# Altium schematic sheet STM32G473RET6_PINOUT.SchDoc
size C; SheetNumber: 14; SheetTotal: 19
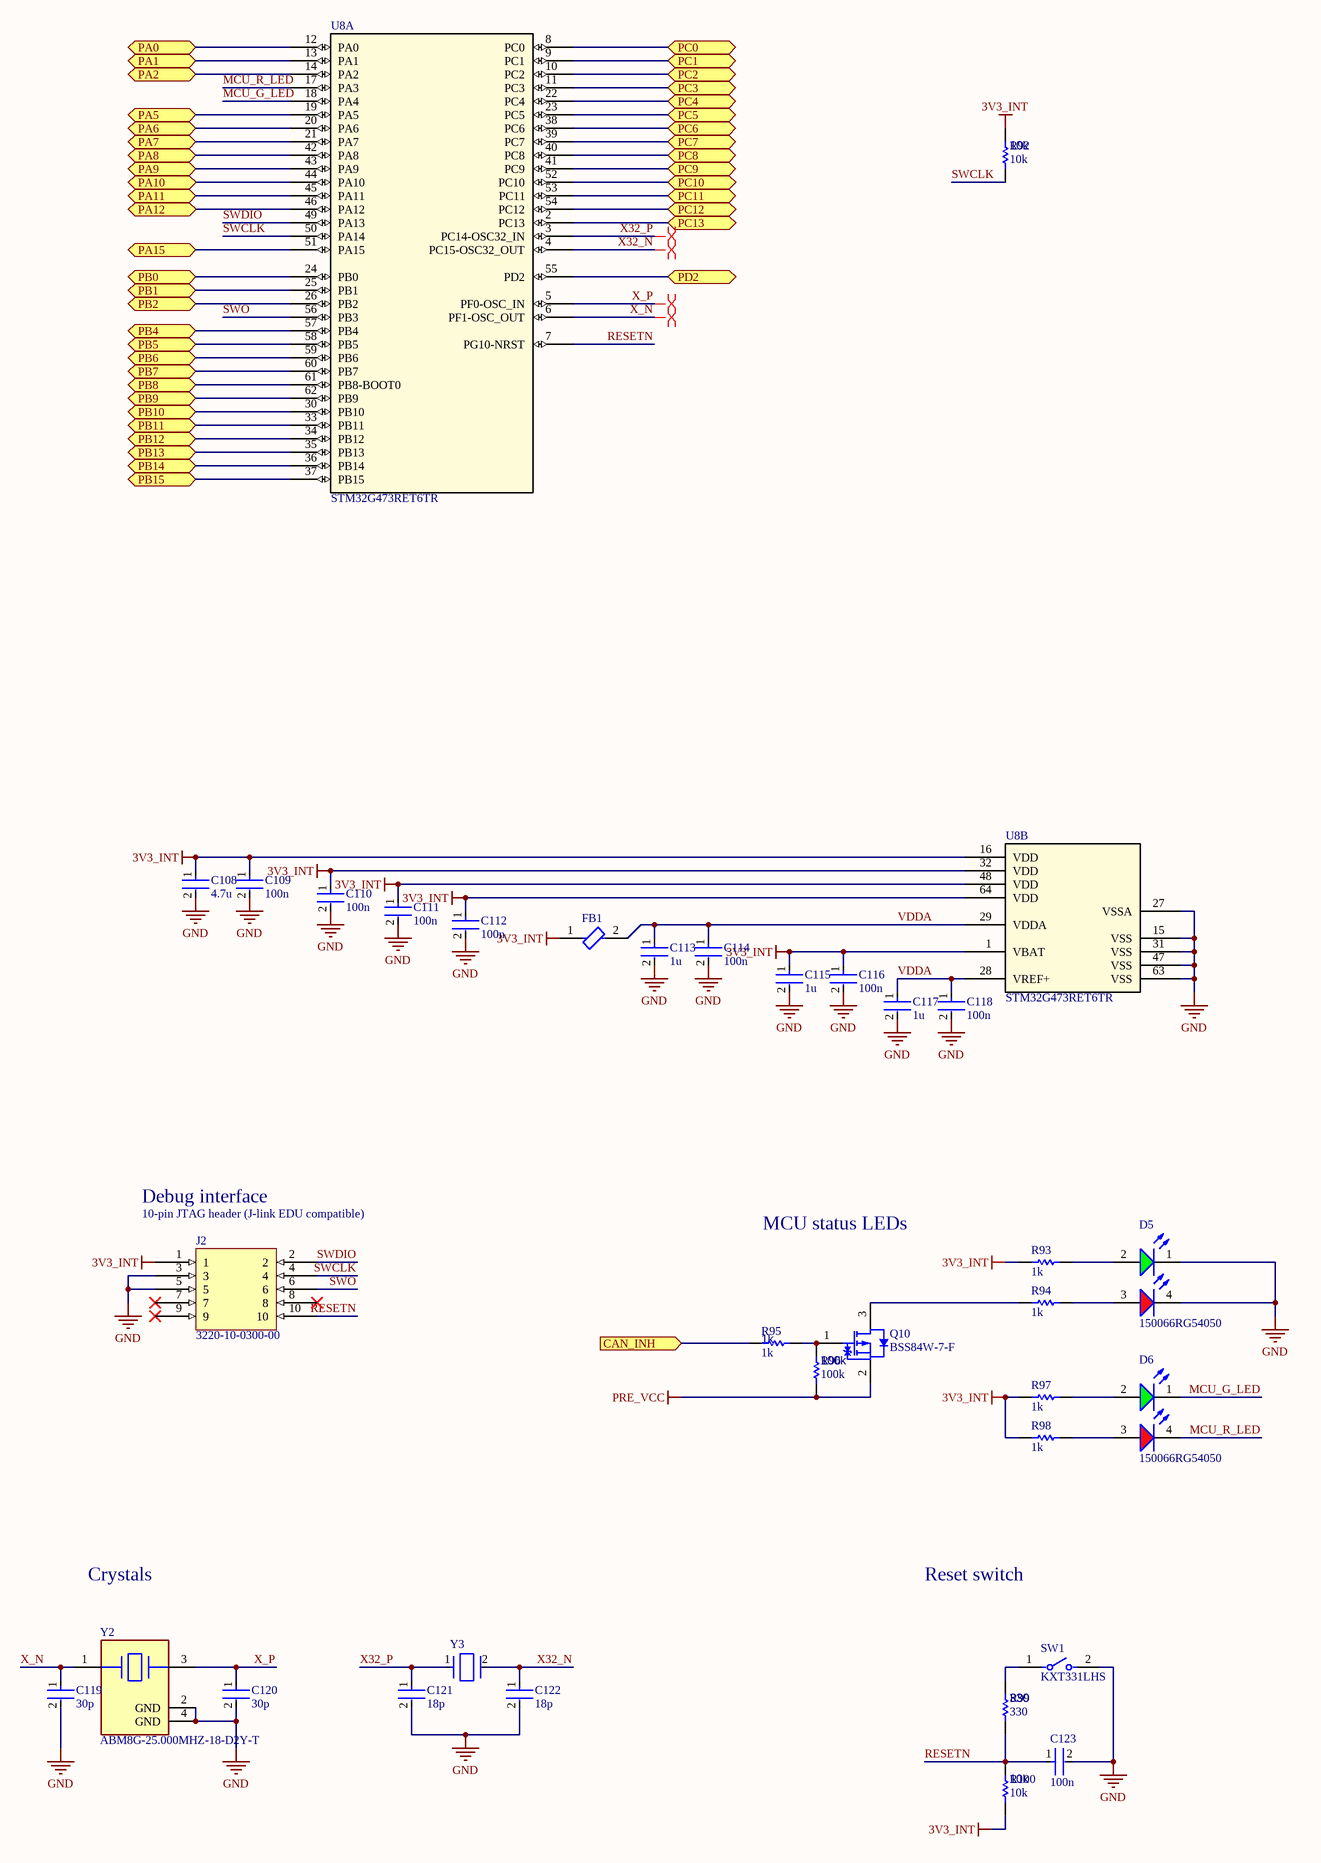
[diagram p0: STM32G473RET6_PINOUT.SchDoc]

## Parts
C108  4.7u  [FP-0402-L_1_0_0_05-W_0_5-IPC_A]
C109  100n  [FP-0402-L_1_0_0_05-W_0_5-IPC_A]
C110  100n  [FP-0402-L_1_0_0_05-W_0_5-IPC_A]
C111  100n  [FP-0402-L_1_0_0_05-W_0_5-IPC_A]
C112  100n  [FP-0402-L_1_0_0_05-W_0_5-IPC_A]
C113  1u  [FP-0402-L_1_0_0_05-W_0_5-IPC_A]
C114  100n  [FP-0402-L_1_0_0_05-W_0_5-IPC_A]
C115  1u  [FP-0402-L_1_0_0_05-W_0_5-IPC_A]
C116  100n  [FP-0402-L_1_0_0_05-W_0_5-IPC_A]
C117  1u  [FP-0402-L_1_0_0_05-W_0_5-IPC_A]
C118  100n  [FP-0402-L_1_0_0_05-W_0_5-IPC_A]
C119  30p  [FP-0402-L_1_0_0_05-W_0_5-IPC_A]
C120  30p  [FP-0402-L_1_0_0_05-W_0_5-IPC_A]
C121  18p  [FP-0402-L_1_0_0_05-W_0_5-IPC_A]
C122  18p  [FP-0402-L_1_0_0_05-W_0_5-IPC_A]
C123  100n  [FP-0402-L_1_0_0_05-W_0_5-IPC_A]
D5  150066RG54050  [WL-SBCD_0606]
D6  150066RG54050  [WL-SBCD_0606]
FB1  BLM15PX601SN1D  [FP-BLM15-0_05-MFG]  (value not drawn)
J2  3220-10-0300-00  [3220-10-0300-00-Footprint-1]
Q10  BSS84W-7-F  [DIOD-SOT323-3_V]
R92  10k  [R0603B]
R93  1k  [R0603B]
R94  1k  [R0603B]
R95  1k  [R0603B]
R96  100k  [R0603B]
R97  1k  [R0603B]
R98  1k  [R0603B]
R99  330  [R0603B]
R100  10k  [R0603B]
SW1  KXT331LHS  [FP-KXT331LHS-MFG]
U8  STM32G473RET6TR  [STM32G473RET6TR-Footprint-1]  (parts A,B of 2)
Y2  ABM8G-25.000MHZ-18-D2Y-T  [FP-ABM8G-MFG]
Y3  ECS-.327-12.5-1210-TR  [FP-ECX-1210-MFG]  (value not drawn)

## Ports
CAN_INH (in), PA0 (bidir), PA1 (bidir), PA2 (bidir), PA5 (bidir), PA6 (bidir), PA7 (bidir), PA8 (bidir), PA9 (bidir), PA10 (bidir), PA11 (bidir), PA12 (bidir), PA15 (bidir), PB0 (bidir), PB1 (bidir), PB2 (bidir), PB4 (bidir), PB5 (bidir), PB6 (bidir), PB7 (bidir), PB8 (bidir), PB9 (bidir), PB10 (bidir), PB11 (bidir), PB12 (bidir), PB13 (bidir), PB14 (bidir), PB15 (bidir), PC0 (bidir), PC1 (bidir), PC2 (bidir), PC3 (bidir), PC4 (bidir), PC5 (bidir), PC6 (bidir), PC7 (bidir), PC8 (bidir), PC9 (bidir), PC10 (bidir), PC11 (bidir), PC12 (bidir), PC13 (bidir), PD2 (bidir)

## Nets
3V3_INT: C108.1 C109.1 C110.1 C111.1 C112.1 C115.1 C116.1 FB1.1 J2.1 R92.2 R93.2 R97.2 R98.2 R100.1 U8.1(VBAT) U8.16(VDD) U8.32(VDD) U8.48(VDD) U8.64(VDD)
GND: C108.2 C109.2 C110.2 C111.2 C112.2 C113.2 C114.2 C115.2 C116.2 C117.2 C118.2 C119.2 C120.2 C121.2 C122.2 C123.2 D5.1(K) D5.4(K) J2.3 J2.5 SW1.2 U8.15(VSS) U8.27(VSSA) U8.31(VSS) U8.47(VSS) U8.63(VSS) Y2.2(GND) Y2.4(GND)
PRE_VCC: Q10.2(S) R96.2
CAN_INH: R95.2 ; port CAN_INH
MCU_G_LED: D6.1(K) U8.18(PA4)
MCU_R_LED: D6.4(K) U8.17(PA3)
PA0: U8.12(PA0) ; port PA0
PA1: U8.13(PA1) ; port PA1
PA2: U8.14(PA2) ; port PA2
PA5: U8.19(PA5) ; port PA5
PA6: U8.20(PA6) ; port PA6
PA7: U8.21(PA7) ; port PA7
PA8: U8.42(PA8) ; port PA8
PA9: U8.43(PA9) ; port PA9
PA10: U8.44(PA10) ; port PA10
PA11: U8.45(PA11) ; port PA11
PA12: U8.46(PA12) ; port PA12
PA15: U8.51(PA15) ; port PA15
PB0: U8.24(PB0) ; port PB0
PB1: U8.25(PB1) ; port PB1
PB2: U8.26(PB2) ; port PB2
PB4: U8.57(PB4) ; port PB4
PB5: U8.58(PB5) ; port PB5
PB6: U8.59(PB6) ; port PB6
PB7: U8.60(PB7) ; port PB7
PB8: U8.61(PB8-BOOT0) ; port PB8
PB9: U8.62(PB9) ; port PB9
PB10: U8.30(PB10) ; port PB10
PB11: U8.33(PB11) ; port PB11
PB12: U8.34(PB12) ; port PB12
PB13: U8.35(PB13) ; port PB13
PB14: U8.36(PB14) ; port PB14
PB15: U8.37(PB15) ; port PB15
PC0: U8.8(PC0) ; port PC0
PC1: U8.9(PC1) ; port PC1
PC2: U8.10(PC2) ; port PC2
PC3: U8.11(PC3) ; port PC3
PC4: U8.22(PC4) ; port PC4
PC5: U8.23(PC5) ; port PC5
PC6: U8.38(PC6) ; port PC6
PC7: U8.39(PC7) ; port PC7
PC8: U8.40(PC8) ; port PC8
PC9: U8.41(PC9) ; port PC9
PC10: U8.52(PC10) ; port PC10
PC11: U8.53(PC11) ; port PC11
PC12: U8.54(PC12) ; port PC12
PC13: U8.2(PC13) ; port PC13
PD2: U8.55(PD2) ; port PD2
RESETN: C123.1 J2.10 R99.1 R100.2 U8.7(PG10-NRST)
SWCLK: J2.4 R92.1 U8.50(PA14)
SWDIO: J2.2 U8.49(PA13)
SWO: J2.6 U8.56(PB3)
VDDA: C113.1 C114.1 C117.1 C118.1 FB1.2 U8.28(VREF+) U8.29(VDDA)
X32_N: C122.1 U8.4(PC15-OSC32_OUT) Y3.2(Out/In)
X32_P: C121.1 U8.3(PC14-OSC32_IN) Y3.1(In/Out)
X_N: C119.1 U8.6(PF1-OSC_OUT) Y2.1
X_P: C120.1 U8.5(PF0-OSC_IN) Y2.3
NetD5_2: D5.2(A) R93.1
NetD5_3: D5.3(A) R94.1
NetD6_2: D6.2(A) R97.1
NetD6_3: D6.3(A) R98.1
NetQ10_1: Q10.1(G) R95.1 R96.1
NetQ10_3: Q10.3(D) R94.2
NetR99_2: R99.2 SW1.1

Not connected (* = marked no-connect by the designer): J2 7* 8* 9*

## Layout directives
differential pair: X32_N, X32_P, X_N, X_P

## Notes on the sheet
- Debug interface
- (near J2) 10-pin JTAG header (J-link EDU compatible)
- MCU status LEDs
- Crystals
- Reset switch

## Library data of the parts
C108-C123 = CMP-001-00058-1: LARGE PADS, 0402 CAP, CHANGE COMMENT TO MATCH REAL P/N; Capacitor Type: Ceramic; Min Operating Temperature: -55°C; Mounting Technology: Surface Mount; Pins: 2; Case/Package: 0402; RoHS Compliant: Yes; Max Operating Temperature: 85°C
  C108: Value: 4.7u
  C109-C112 C114 C116 C118 C123: Value: 100n
  C113 C115 C117: Value: 1u
  C119 C120: Value: 30p
  C121 C122: Value: 18p
D5 D6 = CMP-004-00040-2: Led, Red/Grn, 180Mcd/230Mcd, 624Nm/525Nm Rohs Compliant: Yes; Source: rgled.SchLib; Component Type: Standard; Design Item ID: CMP-004-00034-2; Pins: 4
FB1 = CMP-0686-00252-4: Chip Ferrite Bead, 0402, 600Ω @ 100MHz, 0.23Ω, 25%, 900mA; Number of Circuits: 1; Impedance: 600R; DC Resistance (DCR): 230mR; Material: Steel; Length: 1mm; Package Quantity: 10000; Height: 0.5mm; Width: 0.5mm; Max DC Current: 900mA; Number of Lines: 1; Termination: SMD/SMT; Packaging: Tape and Reel; Lead Free: Lead Free; Min Operating Temperature: -55°C; Max Operating Temperature: 125°C; Max Current Rating: 900mA; Case Code (Imperial): 0402; Number of Pins: 2; Current Rating: 900mA; Test Frequency: 100MHz; Case/Package: 0402; Tolerance: 25%; Case Code (Metric): 1005
J2 = CMP-001-0013-3: CONN HEADER SMD 10POS 1.27MM
Q10 = CMP-2000-06170-1: DIFF P/N!!! / P-Channel Enhancement Mode MOSFET, 310 mW, 20 V, -55 to 150 degC, 3-Pin SOT-323, RoHS, Tape and Reel; Manufacturer: Diodes Inc; Qg Gate Charge: 0.622nC; Drain-Source On Resistance-Max: 750mO; Rated Power Dissipation: 310mW; Drain-to-Source Voltage [Vdss]: 20V; Package Reference: SOT323; Datasheet Version: Rev. 3-2, 09/2013; Package Description: 3-Pin Small Outline Transistor, Body 2 x 1.25 mm, Pitch 0.65 mm; Mounting Technology: SurfaceMount; Manufacturer URL: http://www.diodes.com/; Datasheet URL: http://www.diodes.com/_files/datasheets/ds31861.pdf; Channel Type: P-Channel
R92-R100 = CMP-009-00002-14: Resistor
  R92 R100: Value: 10k
  R93-R95 R97 R98: Value: 1k
  R96: Value: 100k
  R99: Value: 330
SW1 = CMP-10040-000029-1: SWITCH TACTILE SPST-NO 0.02A 15V; Operating Force: 240gf; Switch Travel: 0.13mm; Illumination Type: Non-Illuminated; Throw Configuration: SPST; Number of Ports: 1; Current Rating: 5A; Mechanical Life: 500000Cycles; Switch Function: Off-Mom; Connector Type: USB; Actuator Type: Standard; Gender: Receptacle; Number of Contacts: 24; Contact Plating: Gold; Insulation Color: Black; Min Operating Temperature: -40°C; Packaging: Tape and Reel; Flammability Rating: UL94 V-0; Max Operating Temperature: 85°C; Termination: Solder; Mount: Surface Mount
U8 = CMP-020-00020-2: MCU 32-Bit STM32 ARM Cortex-M4 RISC 512KB Flash 1.71V to 3.6V 64-Pin LQFP T/R; RoHS Compliant: Yes
Y2 = CMP-2000-05733-3: Crystal 25MHz ±20ppm (Tol) ±30ppm (Stability) 18pF FUND 60Ω 4-Pin SMD T/R; Series Resistance: 60R; Length: 3.2mm; Depth: 2.5mm; Packaging: Tape and Reel; Min Operating Temperature: -40°C; Operating Frequency: 25 MHz; Lead Free: Lead Free; Number of Pins: 4; Frequency Tolerance: 20ppm; Radiation Hardening: No; Max Operating Temperature: 85°C; Termination: SMD/SMT; Frequency Stability: 30ppm; Frequency: 25MHz; Series: ABM8G; Mount: Surface Mount; Package Quantity: 1000; Height: 0.039inch; Width: 0.098inch; Case/Package: CSMD; ESR (Equivalent Series Resistance): 60R; Load Capacitance: 18pF; Tolerance: 20ppm
Y3 = CMP-40224-000006-1: CRYSTAL 32.7680KHZ 12.5PF SMD; Manufacturer: ECS International; Frequency: 32.768kHz; Esr: 90kΩ; Tolerance: 20ppm; Device Class L1: Passive Components; Load Capacitance: 12.5pF; Temperature: -40°C to +85°C; ComponentLink2URL: https://ecsxtal.com/store/pdf/ECX-1210.pdf; Series: ECX-1210; Octopart: https://octopart.com/ecs-.327-12.5-1210-tr-ecs+international-81221340; ComponentLink2Description: Datasheet; Temperature Range Low: -40°C; Digikey Description: CRYSTAL 32.7680KHZ 12.5PF SMD; Lead Free: Yes; RoHS: TRUE; Device Class L3: Crystals; Automotive: No; Category: Crys; Height: 0.5mm; Manufacturer Part Number: ECS-.327-12.5-1210-TR; Temperature Range High: +85°C; Device Class L2: Crystals / Oscillators; Package: ECX-1210